# Altium project Group_12_301_Project.PrjPcb
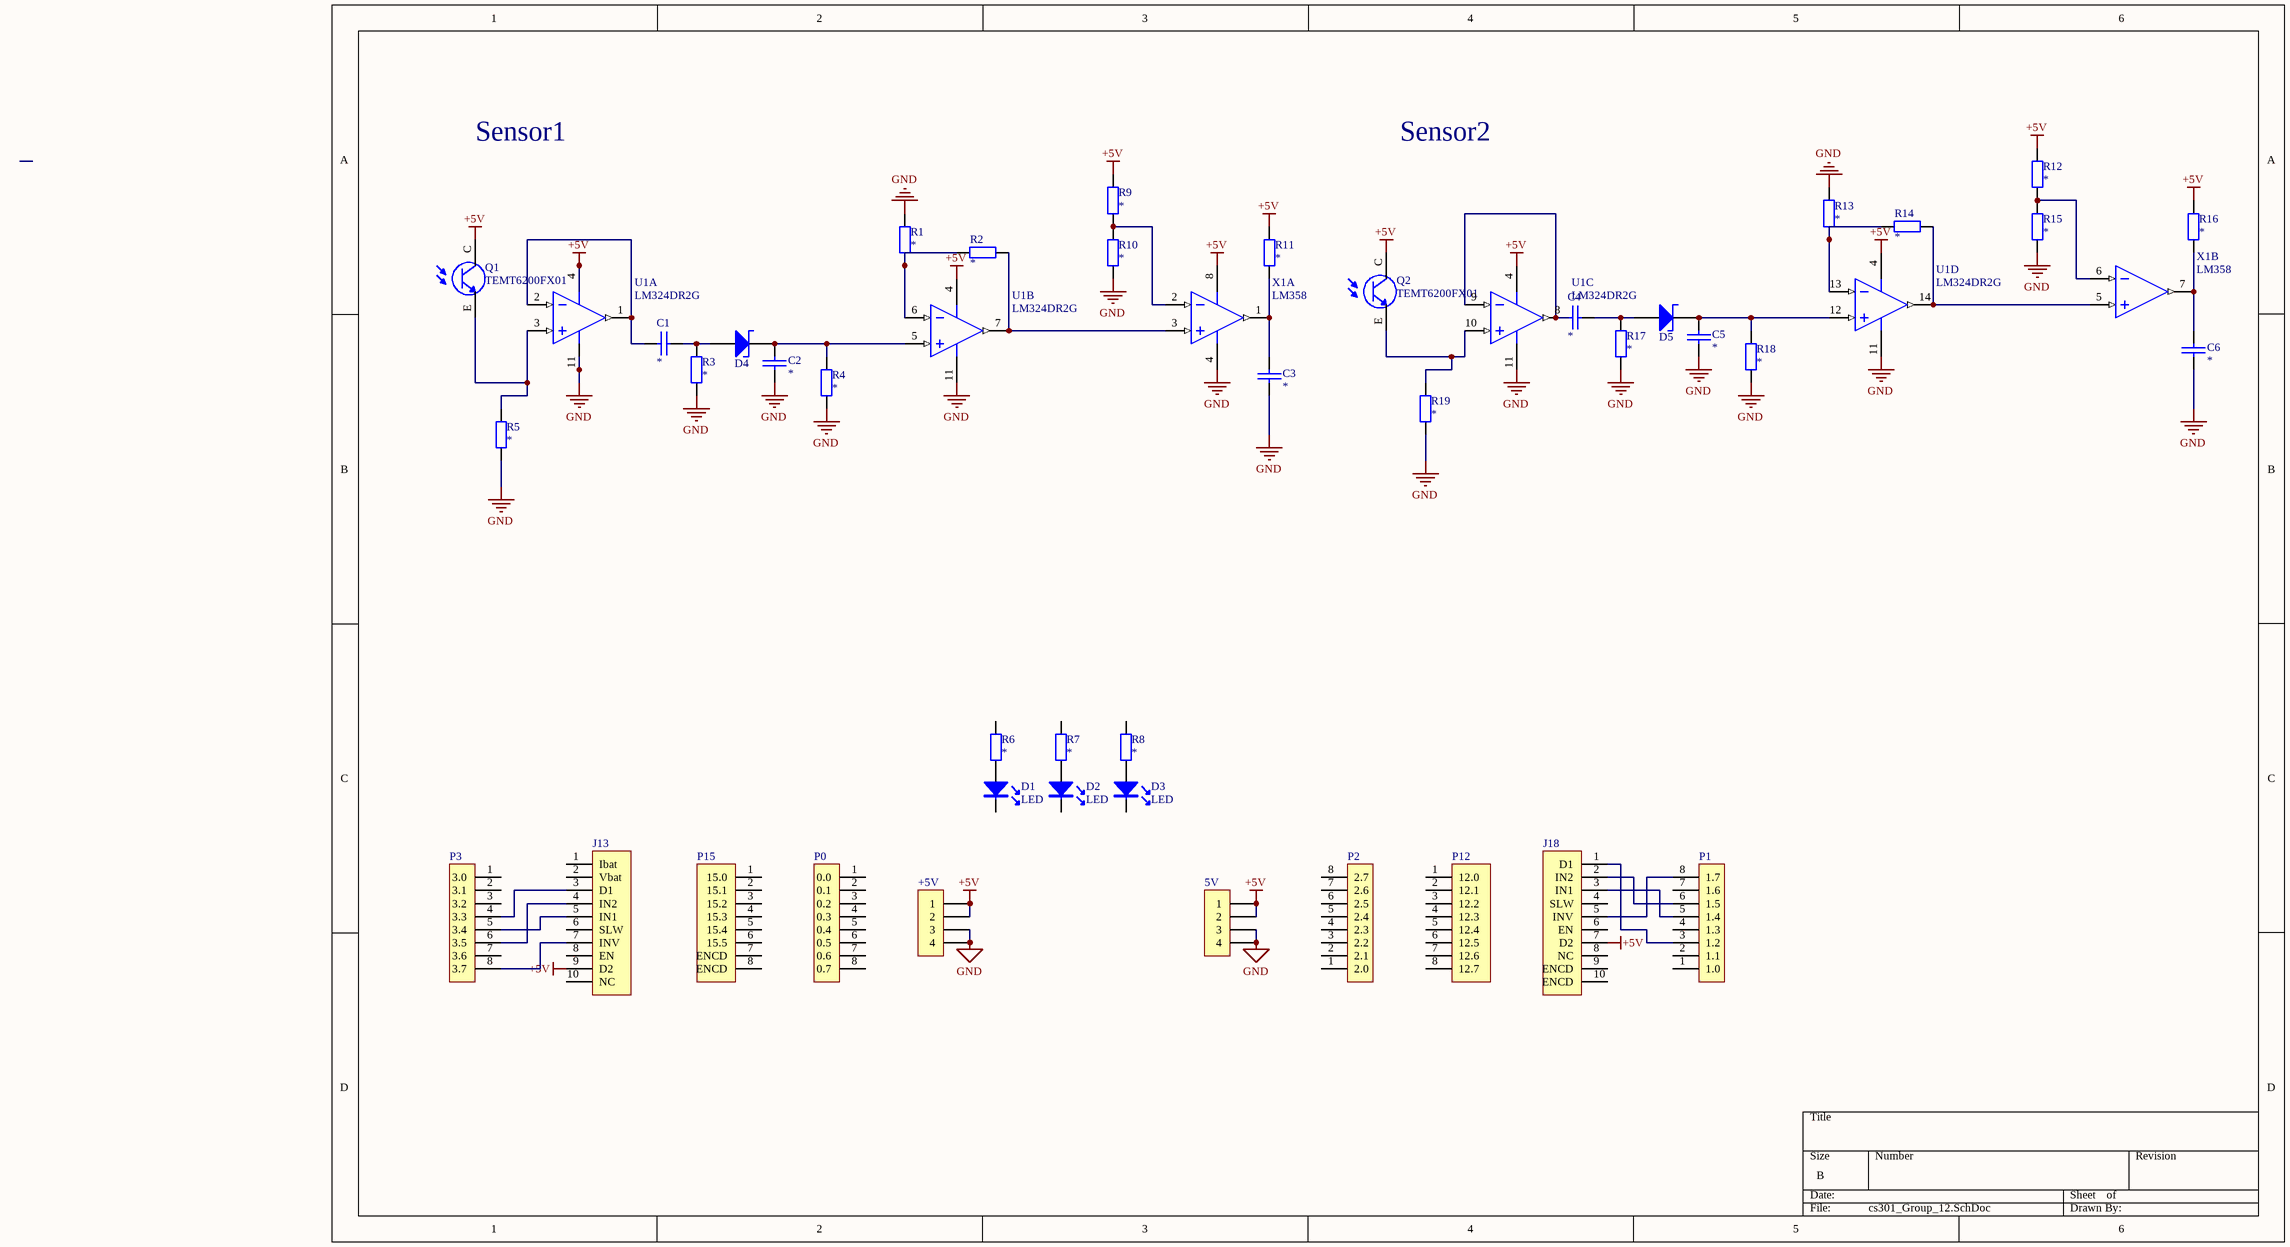
[diagram p0: cs301_Group_12.SchDoc]
2 sheets, 115 parts. Net scope: global (net labels, ports and power ports of the same name join across sheets).
Board file: cs301_YourGroupNumber--4 holes.PcbDoc
Sheets:
  cs301_Group_12.SchDoc
  Sensors.SchDoc

## Sheet cs301_Group_12.SchDoc
size B; SheetNumber: 1; SheetTotal: 2

### Parts
5V  5V  [IDC4]  (value not drawn)
+5V  5V  [IDC4]  (value not drawn)
C1  *  [0805 CAP]
C2  *  [0805 CAP]
C3  *  [0805 CAP]
C4  *  [0805 CAP]
C5  *  [0805 CAP]
C6  *  [0805 CAP]
D1  LED  [LED0.1/5MM]
D2  LED  [LED0.1/5MM]
D3  LED  [LED0.1/5MM]
D4  BZT52H-B4V7  [SOD123]  (value not drawn)
D5  BZT52H-B4V7  [SOD123]  (value not drawn)
J13  CON10  [idc10]  (value not drawn)
J18  CON10  [IDC10]  (value not drawn)
P0  P0  [idc8]  (value not drawn)
P1  P1  [idc8]  (value not drawn)
P2  P2  [idc8]  (value not drawn)
P3  P3  [idc8]  (value not drawn)
P12  P12  [idc8]  (value not drawn)
P15  P15  [idc8]  (value not drawn)
Q1  TEMT6200FX01  [XDCR_TEMT6200FX01]
Q2  TEMT6200FX01  [XDCR_TEMT6200FX01]
R1  *  [0805 RES]
R2  *  [0805 RES]
R3  *  [0805 RES]
R4  *  [0805 RES]
R5  *  [0805 RES]
R6  *  [0805 RES]
R7  *  [0805 RES]
R8  *  [0805 RES]
R9  *  [0805 RES]
R10  *  [0805 RES]
R11  *  [0805 RES]
R12  *  [0805 RES]
R13  *  [0805 RES]
R14  *  [0805 RES]
R15  *  [0805 RES]
R16  *  [0805 RES]
R17  *  [0805 RES]
R18  *  [0805 RES]
R19  *  [0805 RES]
U1  LM324DR2G  [SOIC-14]  (parts A,B,C,D of 4)
X1  LM358  [SO - 8]  (parts A,B of 2)

### Nets
+5V: 5V.1 5V.2 +5V.1 +5V.2 J13.9(D2) J18.7(D2) Q1.C Q2.C R9.1 R11.1 R12.1 R16.1 U1.4(VCC) X1.8(VDD)
GND: 5V.3 5V.4 +5V.3 +5V.4 C2.2 C3.2 C5.2 C6.2 R1.2 R3.1 R4.1 R5.1 R10.2 R13.2 R15.2 R17.1 R18.1 R19.1 U1.11(VEE/GND) X1.4(VSS)
NetC1_1: C1.1 U1.1(OUT1) U1.2(IN1-)
NetC1_2: C1.2 D4.1(A) R3.2
NetC2_1: C2.1 D4.2(K) R4.2 U1.5(IN2+)
NetC3_1: C3.1 R11.2 X1.1(VOUTA)
NetC4_1: C4.1 U1.8(OUT3) U1.9(IN3-)
NetC4_2: C4.2 D5.1(A) R17.2
NetC5_1: C5.1 D5.2(K) R18.2 U1.12(IN4+)
NetC6_1: C6.1 R16.2 X1.7(VOUTA)
NetD1_A: D1.A R6.1
NetD2_A: D2.A R7.1
NetD3_A: D3.A R8.1
NetJ13_3: J13.3(D1) P3.4(3.3)
NetJ13_4: J13.4(IN2) P3.6(3.5)
NetJ13_5: J13.5(IN1) P3.5(3.4)
NetJ13_7: J13.7(INV) P3.8(3.7)
NetJ18_1: J18.1(D1) P1.3(1.2)
NetJ18_2: J18.2(IN2) P1.6(1.5)
NetJ18_3: J18.3(IN1) P1.5(1.4)
NetJ18_5: J18.5(INV) P1.8(1.7)
NetQ1_E: Q1.E R5.2 U1.3(IN1+)
NetQ2_E: Q2.E R19.2 U1.10(IN3+)
NetR1_1: R1.1 R2.2 U1.6(IN2-)
NetR2_1: R2.1 U1.7(OUT2) X1.3(VINA+)
NetR9_2: R9.2 R10.1 X1.2(VINA-)
NetR12_2: R12.2 R15.1 X1.6(VINA-)
NetR13_1: R13.1 R14.2 U1.13(IN4-)
NetR14_1: R14.1 U1.14(OUT4) X1.5(VINA+)

Not connected (* = marked no-connect by the designer): D1 K(2); D2 K(2); D3 K(2); J13 1(Ibat) 2(Vbat) 6(SLW) 8(EN) 10(NC); J18 4(SLW) 6(EN) 8(NC) 9(ENCD) 10(ENCD); P0 1(0.0) 2(0.1) 3(0.2) 4(0.3) 5(0.4) 6(0.5) 7(0.6) 8(0.7); P1 1(1.0) 2(1.1) 4(1.3) 7(1.6); P2 1(2.0) 2(2.1) 3(2.2) 4(2.3) 5(2.4) 6(2.5) 7(2.6) 8(2.7); P3 1(3.0) 2(3.1) 3(3.2) 7(3.6); P12 1(12.0) 2(12.1) 3(12.2) 4(12.3) 5(12.4) 6(12.5) 7(12.6) 8(12.7); P15 1(15.0) 2(15.1) 3(15.2) 4(15.3) 5(15.4) 6(15.5) 7(ENCD) 8(ENCD); R6 2; R7 2; R8 2

### Notes on the sheet
- Sensor1
- Sensor2

### Library data of the parts
5V +5V = CON4: Connector
C1-C6 = CerCap_SMT_0805: SMT ceramic capacitor 0805 size; Value: *
D4 D5 = Zener_SMT_SOD123: SMT zener diode with SOD123 package; Manufacturer: Nexperia USA Inc.; Manufacturer Part Number: BZT52H-B4V7,115; Tolerance: ±2%; Supplier 1: Digi-Key; RoHS: RoHS Compliant; Category: Discrete Semiconductor Products; Stock 1: 0; Pricing 1: 1=0.51, 10=0.408, 100=0.2164, 500=0.14232, 1000=0.09678 (NZD); Packaging: Cut Tape (CT); Part Status: Active; Operating Temperature: -65°C ~ 150°C (TA); Mounting Type: Surface Mount; Package / Case: SOD-123F; Supplier Device Package: SOD-123F; ComponentLink1URL: https://assets.nexperia.com/documents/data-sheet/BZT52H_SER.pdf; ComponentLink1Description: https://assets.nexperia.com/documents/data-sheet/BZT52H_SER.pdf; Supplier Part Number 1: 1727-1611-1-ND
J13 J18 = CON10: Connector
P0-P3 = CON8: Connector
P12 P15 = CON8_1: Connector
Q1 Q2 = TEMT6200FX01: Phototransistors 550nm Top View 0805 (2012 Metric); MF: Vishay Semiconductor; Price: None; Package: 0805 Vishay Semiconductor; Check_prices: https://www.snapeda.com/parts/TEMT6200FX01/Vishay%20Semiconductor%20Opto%20Division/view-part/43955/?ref=eda; Purchase-URL: https://pricing.snapeda.com/search/part/TEMT6200FX01/?ref=eda; MP: TEMT6200FX01; Value: *; SnapEDA_Link: https://www.snapeda.com/parts/TEMT6200FX01/Vishay%20Semiconductor%20Opto%20Division/view-part/43955/?ref=snap; Availability: Good
R1-R19 = Res_SMT_0805: 0805 resistor; Published: 8-Jun-2000; LatestRevisionDate: 17-Jul-2002; LatestRevisionNote: Re-released for DXP Platform.; PackageReference: AXIAL-0.4; Publisher: Altium Limited; Value: *; ComponentLink1Description: https://nz.mouser.com/datasheet/2/315/AOA0000C304-1149620.pdf
U1 = LM324DR_SMT_SOIC16: Single Supply Quad Operational Amplifier, 3 to 32 V, 0 to 70 degC, 14-Pin SOIC, Pb-Free, Tape and Reel; Manufacturer: On Semiconductor; VCC Max (V): 32; VCC Min (V): 3; PackageVersion: Rev. K, 05/2011; ComponentLink3URL: http://www.onsemi.com/pub_link/Collateral/751A-03.PDF; ComponentLink3Description: Package Specification; Packing: Tape and Reel; ComponentLink2URL: http://www.onsemi.cn/pub_link/Collateral/LM324-D.PDF; PackageReference: SOIC-14-751A-03; ComponentLink1URL: http://www.onsemi.com/; PackageDescription: 14-Pin Small Outline Integrated Circuit, Body 8.65 x 3.9 mm, Pitch 1.27 mm; ComponentLink1Description: Manufacturer URL; DatasheetVersion: Rev. 25; Mounting Technology: Surface Mount; RoHS: TRUE; ComponentLink2Description: Datasheet; PartNumber: LM324DR2G
X1 = LM358_SMT_SOIC8: IC OPAMP 8SOIC; ComponentLink1URL: http://www.ti.com/lit/ds/symlink/tlc080a.pdf; ComponentLink1Description: http://www.ti.com/lit/ds/symlink/tlc080a.pdf; Supplier 1: Digi-Key; Supplier Part Number 1: 296-1014-1-ND

## Sheet Sensors.SchDoc
size C; SheetNumber: 2; SheetTotal: 2
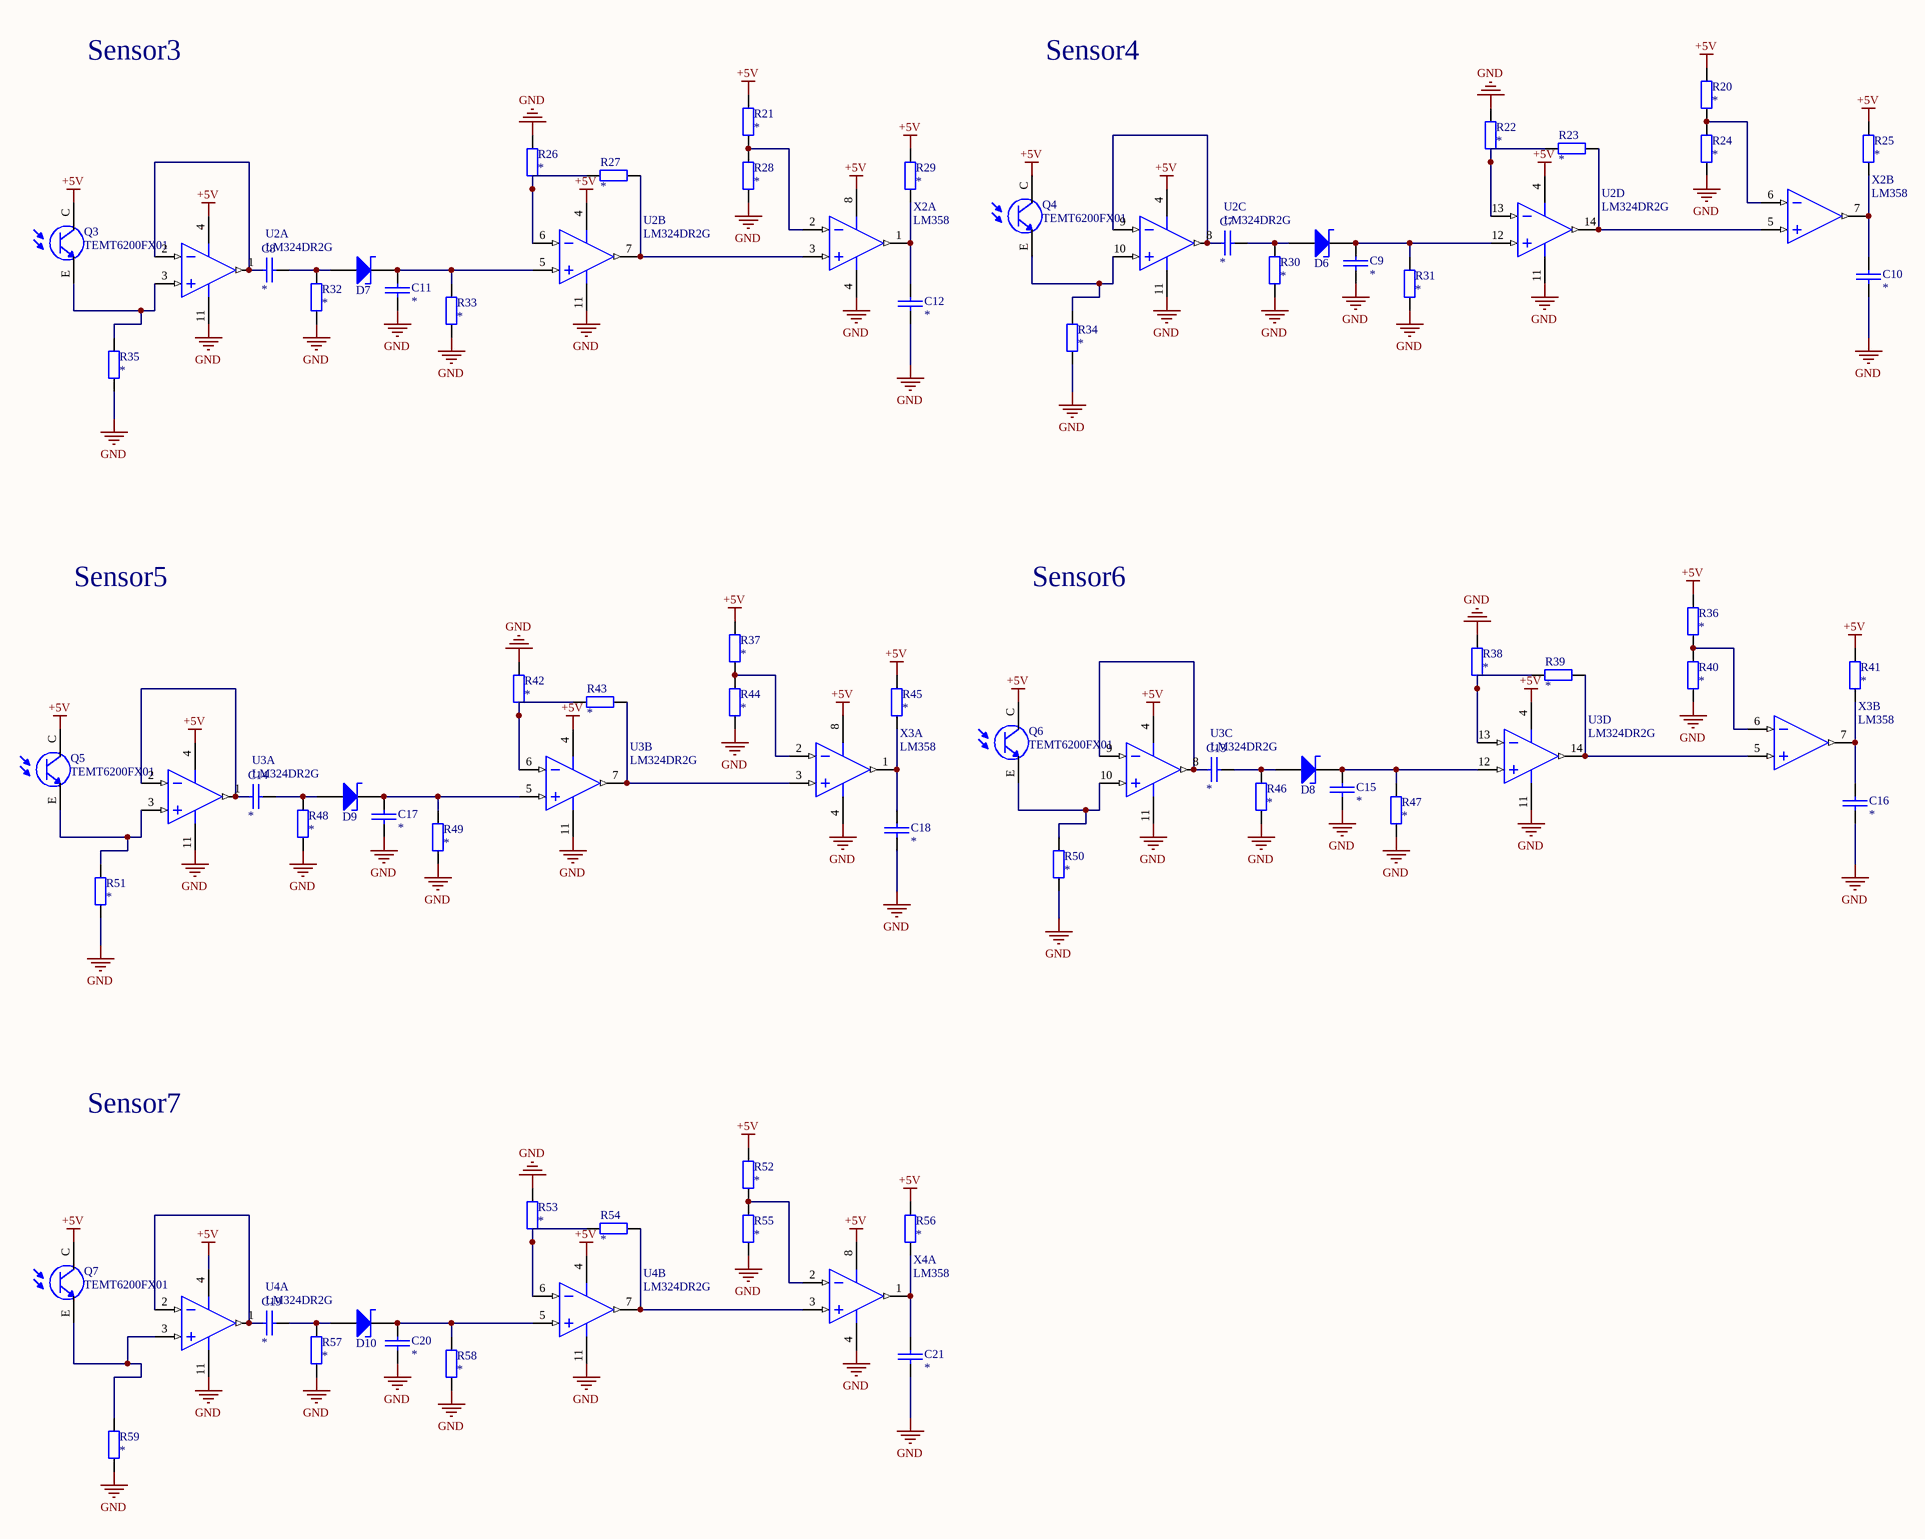
[diagram p1: Sensors.SchDoc]

### Parts
C7  *  [0805 CAP]
C8  *  [0805 CAP]
C9  *  [0805 CAP]
C10  *  [0805 CAP]
C11  *  [0805 CAP]
C12  *  [0805 CAP]
C13  *  [0805 CAP]
C14  *  [0805 CAP]
C15  *  [0805 CAP]
C16  *  [0805 CAP]
C17  *  [0805 CAP]
C18  *  [0805 CAP]
C19  *  [0805 CAP]
C20  *  [0805 CAP]
C21  *  [0805 CAP]
D6  BZT52H-B4V7  [SOD123]  (value not drawn)
D7  BZT52H-B4V7  [SOD123]  (value not drawn)
D8  BZT52H-B4V7  [SOD123]  (value not drawn)
D9  BZT52H-B4V7  [SOD123]  (value not drawn)
D10  BZT52H-B4V7  [SOD123]  (value not drawn)
Q3  TEMT6200FX01  [XDCR_TEMT6200FX01]
Q4  TEMT6200FX01  [XDCR_TEMT6200FX01]
Q5  TEMT6200FX01  [XDCR_TEMT6200FX01]
Q6  TEMT6200FX01  [XDCR_TEMT6200FX01]
Q7  TEMT6200FX01  [XDCR_TEMT6200FX01]
R20  *  [0805 RES]
R21  *  [0805 RES]
R22  *  [0805 RES]
R23  *  [0805 RES]
R24  *  [0805 RES]
R25  *  [0805 RES]
R26  *  [0805 RES]
R27  *  [0805 RES]
R28  *  [0805 RES]
R29  *  [0805 RES]
R30  *  [0805 RES]
R31  *  [0805 RES]
R32  *  [0805 RES]
R33  *  [0805 RES]
R34  *  [0805 RES]
R35  *  [0805 RES]
R36  *  [0805 RES]
R37  *  [0805 RES]
R38  *  [0805 RES]
R39  *  [0805 RES]
R40  *  [0805 RES]
R41  *  [0805 RES]
R42  *  [0805 RES]
R43  *  [0805 RES]
R44  *  [0805 RES]
R45  *  [0805 RES]
R46  *  [0805 RES]
R47  *  [0805 RES]
R48  *  [0805 RES]
R49  *  [0805 RES]
R50  *  [0805 RES]
R51  *  [0805 RES]
R52  *  [0805 RES]
R53  *  [0805 RES]
R54  *  [0805 RES]
R55  *  [0805 RES]
R56  *  [0805 RES]
R57  *  [0805 RES]
R58  *  [0805 RES]
R59  *  [0805 RES]
U2  LM324DR2G  [SOIC-14]  (parts A,B,C,D of 4)
U3  LM324DR2G  [SOIC-14]  (parts A,B,C,D of 4)
U4  LM324DR2G  [SOIC-14]  (parts A,B of 4)
X2  LM358  [SO - 8]  (parts A,B of 2)
X3  LM358  [SO - 8]  (parts A,B of 2)
X4  LM358  [SO - 8]  (part A of 2)

### Nets
+5V: Q3.C Q4.C Q5.C Q6.C Q7.C R20.1 R21.1 R25.1 R29.1 R36.1 R37.1 R41.1 R45.1 R52.1 R56.1 U2.4(VCC) U3.4(VCC) U4.4(VCC) X2.8(VDD) X3.8(VDD) X4.8(VDD)
GND: C9.2 C10.2 C11.2 C12.2 C15.2 C16.2 C17.2 C18.2 C20.2 C21.2 R22.2 R24.2 R26.2 R28.2 R30.1 R31.1 R32.1 R33.1 R34.1 R35.1 R38.2 R40.2 R42.2 R44.2 R46.1 R47.1 R48.1 R49.1 R50.1 R51.1 R53.2 R55.2 R57.1 R58.1 R59.1 U2.11(VEE/GND) U3.11(VEE/GND) U4.11(VEE/GND) X2.4(VSS) X3.4(VSS) X4.4(VSS)
NetC7_1: C7.1 U2.8(OUT3) U2.9(IN3-)
NetC7_2: C7.2 D6.1(A) R30.2
NetC8_1: C8.1 U2.1(OUT1) U2.2(IN1-)
NetC8_2: C8.2 D7.1(A) R32.2
NetC9_1: C9.1 D6.2(K) R31.2 U2.12(IN4+)
NetC10_1: C10.1 R25.2 X2.7(VOUTA)
NetC11_1: C11.1 D7.2(K) R33.2 U2.5(IN2+)
NetC12_1: C12.1 R29.2 X2.1(VOUTA)
NetC13_1: C13.1 U3.8(OUT3) U3.9(IN3-)
NetC13_2: C13.2 D8.1(A) R46.2
NetC14_1: C14.1 U3.1(OUT1) U3.2(IN1-)
NetC14_2: C14.2 D9.1(A) R48.2
NetC15_1: C15.1 D8.2(K) R47.2 U3.12(IN4+)
NetC16_1: C16.1 R41.2 X3.7(VOUTA)
NetC17_1: C17.1 D9.2(K) R49.2 U3.5(IN2+)
NetC18_1: C18.1 R45.2 X3.1(VOUTA)
NetC19_1: C19.1 U4.1(OUT1) U4.2(IN1-)
NetC19_2: C19.2 D10.1(A) R57.2
NetC20_1: C20.1 D10.2(K) R58.2 U4.5(IN2+)
NetC21_1: C21.1 R56.2 X4.1(VOUTA)
NetQ3_E: Q3.E R35.2 U2.3(IN1+)
NetQ4_E: Q4.E R34.2 U2.10(IN3+)
NetQ5_E: Q5.E R51.2 U3.3(IN1+)
NetQ6_E: Q6.E R50.2 U3.10(IN3+)
NetQ7_E: Q7.E R59.2 U4.3(IN1+)
NetR20_2: R20.2 R24.1 X2.6(VINA-)
NetR21_2: R21.2 R28.1 X2.2(VINA-)
NetR22_1: R22.1 R23.2 U2.13(IN4-)
NetR23_1: R23.1 U2.14(OUT4) X2.5(VINA+)
NetR26_1: R26.1 R27.2 U2.6(IN2-)
NetR27_1: R27.1 U2.7(OUT2) X2.3(VINA+)
NetR36_2: R36.2 R40.1 X3.6(VINA-)
NetR37_2: R37.2 R44.1 X3.2(VINA-)
NetR38_1: R38.1 R39.2 U3.13(IN4-)
NetR39_1: R39.1 U3.14(OUT4) X3.5(VINA+)
NetR42_1: R42.1 R43.2 U3.6(IN2-)
NetR43_1: R43.1 U3.7(OUT2) X3.3(VINA+)
NetR52_2: R52.2 R55.1 X4.2(VINA-)
NetR53_1: R53.1 R54.2 U4.6(IN2-)
NetR54_1: R54.1 U4.7(OUT2) X4.3(VINA+)

### Notes on the sheet
- Sensor3
- Sensor4
- Sensor5
- Sensor6
- Sensor7

### Library data of the parts
C7-C21 = CerCap_SMT_0805: SMT ceramic capacitor 0805 size; Value: *
D6-D10 = Zener_SMT_SOD123: as D4 on sheet cs301_Group_12; Supplier 1: Digi-Key; RoHS: RoHS Compliant; Category: Discrete Semiconductor Products; Stock 1: 0; Pricing 1: 1=0.51, 10=0.408, 100=0.2164, 500=0.14232, 1000=0.09678 (NZD); Packaging: Cut Tape (CT); Part Status: Active; Operating Temperature: -65°C ~ 150°C (TA); Mounting Type: Surface Mount; Package / Case: SOD-123F; Supplier Device Package: SOD-123F; ComponentLink1URL: https://assets.nexperia.com/documents/data-sheet/BZT52H_SER.pdf; ComponentLink1Description: https://assets.nexperia.com/documents/data-sheet/BZT52H_SER.pdf; Supplier Part Number 1: 1727-1611-1-ND
Q3-Q7 = TEMT6200FX01: as Q1 on sheet cs301_Group_12; Price: None; Package: 0805 Vishay Semiconductor; Check_prices: https://www.snapeda.com/parts/TEMT6200FX01/Vishay%20Semiconductor%20Opto%20Division/view-part/43955/?ref=eda; Purchase-URL: https://pricing.snapeda.com/search/part/TEMT6200FX01/?ref=eda; MP: TEMT6200FX01; Value: *; SnapEDA_Link: https://www.snapeda.com/parts/TEMT6200FX01/Vishay%20Semiconductor%20Opto%20Division/view-part/43955/?ref=snap; Availability: Good
R20-R59 = Res_SMT_0805: 0805 resistor; Published: 8-Jun-2000; LatestRevisionDate: 17-Jul-2002; LatestRevisionNote: Re-released for DXP Platform.; PackageReference: AXIAL-0.4; Publisher: Altium Limited; Value: *; ComponentLink1Description: https://nz.mouser.com/datasheet/2/315/AOA0000C304-1149620.pdf
U2-U4 = LM324DR_SMT_SOIC16: as U1 on sheet cs301_Group_12; PackageVersion: Rev. K, 05/2011; ComponentLink3URL: http://www.onsemi.com/pub_link/Collateral/751A-03.PDF; ComponentLink3Description: Package Specification; Packing: Tape and Reel; ComponentLink2URL: http://www.onsemi.cn/pub_link/Collateral/LM324-D.PDF; PackageReference: SOIC-14-751A-03; ComponentLink1URL: http://www.onsemi.com/; PackageDescription: 14-Pin Small Outline Integrated Circuit, Body 8.65 x 3.9 mm, Pitch 1.27 mm; ComponentLink1Description: Manufacturer URL; DatasheetVersion: Rev. 25; Mounting Technology: Surface Mount; RoHS: TRUE; ComponentLink2Description: Datasheet; PartNumber: LM324DR2G
X2-X4 = LM358_SMT_SOIC8: IC OPAMP 8SOIC; ComponentLink1URL: http://www.ti.com/lit/ds/symlink/tlc080a.pdf; ComponentLink1Description: http://www.ti.com/lit/ds/symlink/tlc080a.pdf; Supplier 1: Digi-Key; Supplier Part Number 1: 296-1014-1-ND

## Nets that join several sheets
+5V: cs301_Group_12 (14 pins), Sensors (21 pins)
GND: cs301_Group_12 (20 pins), Sensors (41 pins)